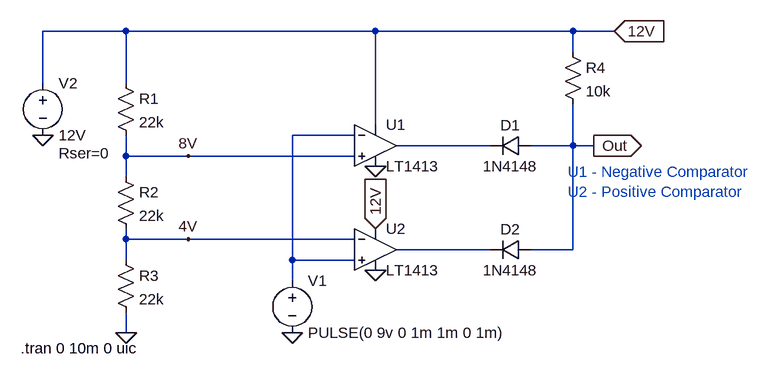
[diagram p0: schematic window_comparator.asc]
window_comparator.asc, the LTspice schematic file:
Version 4
SHEET 1 880 680
WIRE -176 -64 -304 -64
WIRE 208 -64 -176 -64
WIRE 512 -64 208 -64
WIRE 576 -64 512 -64
WIRE 512 -32 512 -64
WIRE -304 16 -304 -64
WIRE -176 16 -176 -64
WIRE 208 80 208 -64
WIRE 176 96 80 96
WIRE 384 112 240 112
WIRE 512 112 512 48
WIRE 512 112 448 112
WIRE 544 112 512 112
WIRE -176 128 -176 96
WIRE -80 128 -176 128
WIRE 176 128 -80 128
WIRE -176 160 -176 128
WIRE -176 256 -176 240
WIRE -80 256 -176 256
WIRE 176 256 -80 256
WIRE 384 272 240 272
WIRE 512 272 512 112
WIRE 512 272 448 272
WIRE -176 288 -176 256
WIRE 80 288 80 96
WIRE 176 288 80 288
WIRE 80 320 80 288
WIRE -176 400 -176 368
FLAG -176 400 0
FLAG 80 400 0
FLAG -304 96 0
FLAG 208 304 0
FLAG 208 144 0
FLAG 576 -64 12V
IOPIN 576 -64 In
FLAG 544 112 Out
IOPIN 544 112 Out
FLAG 208 240 12V
IOPIN 208 240 In
FLAG -80 128 8V
FLAG -80 256 4V
SYMBOL OpAmps\\LT1413 208 48 R0
SYMATTR InstName U1
SYMBOL OpAmps\\LT1413 208 208 R0
SYMATTR InstName U2
SYMBOL diode 448 96 R90
WINDOW 0 0 32 VBottom 2
WINDOW 3 32 32 VTop 2
SYMATTR InstName D1
SYMATTR Value 1N4148
SYMBOL diode 448 256 R90
WINDOW 0 0 32 VBottom 2
WINDOW 3 32 32 VTop 2
SYMATTR InstName D2
SYMATTR Value 1N4148
SYMBOL voltage 80 304 R0
WINDOW 123 0 0 Left 0
WINDOW 39 0 0 Left 0
SYMATTR InstName V1
SYMATTR Value PULSE(0 9v 0 1m 1m 0 1m)
SYMBOL res -192 0 R0
SYMATTR InstName R1
SYMATTR Value 22k
SYMBOL res -192 144 R0
SYMATTR InstName R2
SYMATTR Value 22k
SYMBOL res -192 272 R0
SYMATTR InstName R3
SYMATTR Value 22k
SYMBOL voltage -304 0 R0
WINDOW 123 0 0 Left 0
WINDOW 39 24 124 Left 2
SYMATTR InstName V2
SYMATTR Value 12V
SYMATTR SpiceLine Rser=0
SYMBOL res 496 -48 R0
SYMATTR InstName R4
SYMATTR Value 10k
TEXT 504 152 Left 2 ;U1 - Negative Comparator\nU2 - Positive Comparator
TEXT -338 424 Left 2 !.tran 0 10m 0 uic

The netlist it stands for:
* window_comparator.asc
XU1 8V N001 12V 0 N002 LT1413  ; pins In+ In- V+ V- OUT
XU2 N001 4V 12V 0 N003 LT1413  ; pins In+ In- V+ V- OUT
D1 Out N002 1N4148
D2 Out N003 1N4148
V1 N001 0 PULSE(0 9v 0 1m 1m 0 1m)
R1 12V 8V 22k
R2 8V 4V 22k
R3 4V 0 22k
V2 12V 0 12V Rser=0
R4 12V Out 10k
.model D D
.lib standard.dio
* U1 - Negative Comparator
* U2 - Positive Comparator
.tran 0 10m 0 uic
.lib LTC.lib
.backanno
.end